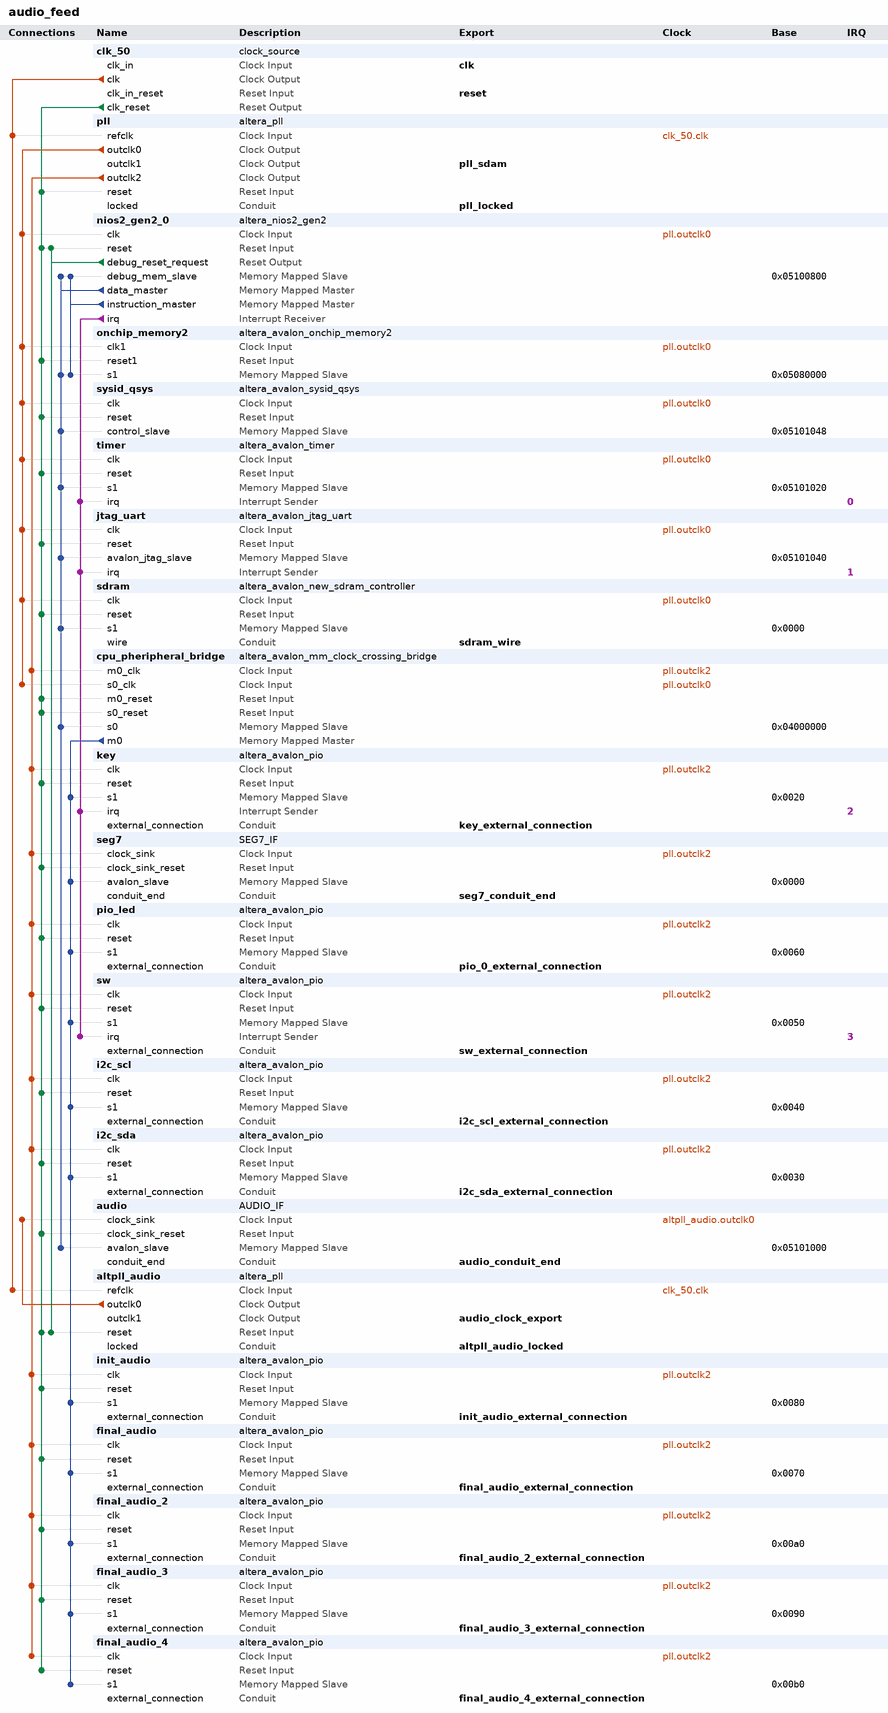
[diagram p0: system contents]
# Platform Designer (Qsys) system audio_feed, Cyclone V 5CSEMA5F31C6
# Parameters at their usual value, and those the tool derives, are not listed.
package require -exact qsys 20.1
create_system audio_feed
set_project_property DEVICE_FAMILY {Cyclone V}
set_project_property DEVICE 5CSEMA5F31C6

add_instance clk_50 clock_source 20.1
set_instance_parameter_value clk_50 clockFrequency 50000000

add_instance pll altera_pll 20.1
set_instance_parameter_value pll gui_device_speed_grade 1
set_instance_parameter_value pll gui_number_of_clocks 3
set_instance_parameter_value pll gui_operation_mode normal
set_instance_parameter_value pll gui_output_clock_frequency0 100.0
set_instance_parameter_value pll gui_output_clock_frequency1 100.0
set_instance_parameter_value pll gui_output_clock_frequency2 10.0
set_instance_parameter_value pll gui_phase_shift_deg1 -90.0
set_instance_parameter_value pll gui_pll_mode {Integer-N PLL}
set_instance_parameter_value pll gui_ps_units1 degrees
set_instance_parameter_value pll gui_reference_clock_frequency 50.0
set_instance_parameter_value pll gui_use_locked true

add_instance nios2_gen2_0 altera_nios2_gen2 20.1
set_instance_parameter_value nios2_gen2_0 dcache_size 2048
set_instance_parameter_value nios2_gen2_0 exceptionSlave onchip_memory2.s1
set_instance_parameter_value nios2_gen2_0 icache_size 4096
set_instance_parameter_value nios2_gen2_0 impl Tiny
set_instance_parameter_value nios2_gen2_0 resetSlave onchip_memory2.s1

add_instance onchip_memory2 altera_avalon_onchip_memory2 20.1
set_instance_parameter_value onchip_memory2 dataWidth 32
set_instance_parameter_value onchip_memory2 dualPort false
set_instance_parameter_value onchip_memory2 initMemContent true
set_instance_parameter_value onchip_memory2 initializationFileName onchip_mem.hex
set_instance_parameter_value onchip_memory2 memorySize 320000

add_instance sysid_qsys altera_avalon_sysid_qsys 20.1
set_instance_parameter_value sysid_qsys id 0

add_instance timer altera_avalon_timer 20.1
set_instance_parameter_value timer period 1
set_instance_parameter_value timer periodUnits MSEC

add_instance jtag_uart altera_avalon_jtag_uart 20.1
set_instance_parameter_value jtag_uart simInteractiveOptions NO_INTERACTIVE_WINDOWS

add_instance sdram altera_avalon_new_sdram_controller 20.1
set_instance_parameter_value sdram TAC 6.0
set_instance_parameter_value sdram TRCD 20.0
set_instance_parameter_value sdram TRP 20.0
set_instance_parameter_value sdram casLatency 3
set_instance_parameter_value sdram columnWidth 10
set_instance_parameter_value sdram dataWidth 16
set_instance_parameter_value sdram generateSimulationModel true
set_instance_parameter_value sdram model single_Micron_MT48LC4M32B2_7_chip
set_instance_parameter_value sdram numberOfBanks 4
set_instance_parameter_value sdram numberOfChipSelects 1
set_instance_parameter_value sdram powerUpDelay 100.0
set_instance_parameter_value sdram refreshPeriod 15.625
set_instance_parameter_value sdram rowWidth 13

add_instance cpu_pheripheral_bridge altera_avalon_mm_clock_crossing_bridge 20.1
set_instance_parameter_value cpu_pheripheral_bridge ADDRESS_WIDTH 9
set_instance_parameter_value cpu_pheripheral_bridge COMMAND_FIFO_DEPTH 32
set_instance_parameter_value cpu_pheripheral_bridge DATA_WIDTH 32
set_instance_parameter_value cpu_pheripheral_bridge MASTER_SYNC_DEPTH 3
set_instance_parameter_value cpu_pheripheral_bridge MAX_BURST_SIZE 1
set_instance_parameter_value cpu_pheripheral_bridge RESPONSE_FIFO_DEPTH 64
set_instance_parameter_value cpu_pheripheral_bridge SLAVE_SYNC_DEPTH 3
set_instance_parameter_value cpu_pheripheral_bridge USE_AUTO_ADDRESS_WIDTH 0

add_instance key altera_avalon_pio 20.1
set_instance_parameter_value key captureEdge true
set_instance_parameter_value key direction Input
set_instance_parameter_value key edgeType FALLING
set_instance_parameter_value key generateIRQ true
set_instance_parameter_value key irqType EDGE
set_instance_parameter_value key simDoTestBenchWiring true
set_instance_parameter_value key simDrivenValue 15
set_instance_parameter_value key width 4

add_instance seg7 SEG7_IF 1.0
set_instance_parameter_value seg7 SEG7_NUM 6

add_instance pio_led altera_avalon_pio 20.1
set_instance_parameter_value pio_led direction Output
set_instance_parameter_value pio_led width 10

add_instance sw altera_avalon_pio 20.1
set_instance_parameter_value sw captureEdge true
set_instance_parameter_value sw direction Input
set_instance_parameter_value sw edgeType FALLING
set_instance_parameter_value sw generateIRQ true
set_instance_parameter_value sw irqType EDGE
set_instance_parameter_value sw simDoTestBenchWiring true
set_instance_parameter_value sw width 10

add_instance i2c_scl altera_avalon_pio 20.1
set_instance_parameter_value i2c_scl direction Output
set_instance_parameter_value i2c_scl width 1

add_instance i2c_sda altera_avalon_pio 20.1
set_instance_parameter_value i2c_sda direction Bidir
set_instance_parameter_value i2c_sda width 1

add_instance audio AUDIO_IF 1.0

add_instance altpll_audio altera_pll 20.1
set_instance_parameter_value altpll_audio gui_device_speed_grade 1
set_instance_parameter_value altpll_audio gui_number_of_clocks 2
set_instance_parameter_value altpll_audio gui_operation_mode normal
set_instance_parameter_value altpll_audio gui_output_clock_frequency0 18.432
set_instance_parameter_value altpll_audio gui_output_clock_frequency1 18.432
set_instance_parameter_value altpll_audio gui_pll_mode {Fractional-N PLL}
set_instance_parameter_value altpll_audio gui_reference_clock_frequency 50.0
set_instance_parameter_value altpll_audio gui_use_locked true

add_instance init_audio altera_avalon_pio 20.1
set_instance_parameter_value init_audio direction Output
set_instance_parameter_value init_audio width 16

add_instance final_audio altera_avalon_pio 20.1
set_instance_parameter_value final_audio direction Input
set_instance_parameter_value final_audio width 16

add_instance final_audio_2 altera_avalon_pio 20.1
set_instance_parameter_value final_audio_2 direction Input
set_instance_parameter_value final_audio_2 width 16

add_instance final_audio_3 altera_avalon_pio 20.1
set_instance_parameter_value final_audio_3 direction Input
set_instance_parameter_value final_audio_3 width 16

add_instance final_audio_4 altera_avalon_pio 20.1
set_instance_parameter_value final_audio_4 direction Input
set_instance_parameter_value final_audio_4 width 16

# connections
add_connection altpll_audio.outclk0 audio.clock_sink clock
add_connection clk_50.clk altpll_audio.refclk clock
add_connection clk_50.clk pll.refclk clock
add_connection pll.outclk0 cpu_pheripheral_bridge.s0_clk clock
add_connection pll.outclk0 jtag_uart.clk clock
add_connection pll.outclk0 nios2_gen2_0.clk clock
add_connection pll.outclk0 onchip_memory2.clk1 clock
add_connection pll.outclk0 sdram.clk clock
add_connection pll.outclk0 sysid_qsys.clk clock
add_connection pll.outclk0 timer.clk clock
add_connection pll.outclk2 cpu_pheripheral_bridge.m0_clk clock
add_connection pll.outclk2 final_audio.clk clock
add_connection pll.outclk2 final_audio_2.clk clock
add_connection pll.outclk2 final_audio_3.clk clock
add_connection pll.outclk2 final_audio_4.clk clock
add_connection pll.outclk2 i2c_scl.clk clock
add_connection pll.outclk2 i2c_sda.clk clock
add_connection pll.outclk2 init_audio.clk clock
add_connection pll.outclk2 key.clk clock
add_connection pll.outclk2 pio_led.clk clock
add_connection pll.outclk2 seg7.clock_sink clock
add_connection pll.outclk2 sw.clk clock
add_connection clk_50.clk_reset altpll_audio.reset reset
add_connection clk_50.clk_reset audio.clock_sink_reset reset
add_connection clk_50.clk_reset cpu_pheripheral_bridge.m0_reset reset
add_connection clk_50.clk_reset cpu_pheripheral_bridge.s0_reset reset
add_connection clk_50.clk_reset final_audio.reset reset
add_connection clk_50.clk_reset final_audio_2.reset reset
add_connection clk_50.clk_reset final_audio_3.reset reset
add_connection clk_50.clk_reset final_audio_4.reset reset
add_connection clk_50.clk_reset i2c_scl.reset reset
add_connection clk_50.clk_reset i2c_sda.reset reset
add_connection clk_50.clk_reset init_audio.reset reset
add_connection clk_50.clk_reset jtag_uart.reset reset
add_connection clk_50.clk_reset key.reset reset
add_connection clk_50.clk_reset nios2_gen2_0.reset reset
add_connection clk_50.clk_reset onchip_memory2.reset1 reset
add_connection clk_50.clk_reset pio_led.reset reset
add_connection clk_50.clk_reset pll.reset reset
add_connection clk_50.clk_reset sdram.reset reset
add_connection clk_50.clk_reset seg7.clock_sink_reset reset
add_connection clk_50.clk_reset sw.reset reset
add_connection clk_50.clk_reset sysid_qsys.reset reset
add_connection clk_50.clk_reset timer.reset reset
add_connection nios2_gen2_0.debug_reset_request altpll_audio.reset reset
add_connection nios2_gen2_0.debug_reset_request nios2_gen2_0.reset reset
add_connection cpu_pheripheral_bridge.m0 final_audio.s1 avalon
set_connection_parameter_value cpu_pheripheral_bridge.m0/final_audio.s1 baseAddress 0x0070
add_connection cpu_pheripheral_bridge.m0 final_audio_2.s1 avalon
set_connection_parameter_value cpu_pheripheral_bridge.m0/final_audio_2.s1 baseAddress 0x00a0
add_connection cpu_pheripheral_bridge.m0 final_audio_3.s1 avalon
set_connection_parameter_value cpu_pheripheral_bridge.m0/final_audio_3.s1 baseAddress 0x0090
add_connection cpu_pheripheral_bridge.m0 final_audio_4.s1 avalon
set_connection_parameter_value cpu_pheripheral_bridge.m0/final_audio_4.s1 baseAddress 0x00b0
add_connection cpu_pheripheral_bridge.m0 i2c_scl.s1 avalon
set_connection_parameter_value cpu_pheripheral_bridge.m0/i2c_scl.s1 baseAddress 0x0040
add_connection cpu_pheripheral_bridge.m0 i2c_sda.s1 avalon
set_connection_parameter_value cpu_pheripheral_bridge.m0/i2c_sda.s1 baseAddress 0x0030
add_connection cpu_pheripheral_bridge.m0 init_audio.s1 avalon
set_connection_parameter_value cpu_pheripheral_bridge.m0/init_audio.s1 baseAddress 0x0080
add_connection cpu_pheripheral_bridge.m0 key.s1 avalon
set_connection_parameter_value cpu_pheripheral_bridge.m0/key.s1 baseAddress 0x0020
add_connection cpu_pheripheral_bridge.m0 pio_led.s1 avalon
set_connection_parameter_value cpu_pheripheral_bridge.m0/pio_led.s1 baseAddress 0x0060
add_connection cpu_pheripheral_bridge.m0 seg7.avalon_slave avalon
set_connection_parameter_value cpu_pheripheral_bridge.m0/seg7.avalon_slave baseAddress 0x0000
add_connection cpu_pheripheral_bridge.m0 sw.s1 avalon
set_connection_parameter_value cpu_pheripheral_bridge.m0/sw.s1 baseAddress 0x0050
add_connection nios2_gen2_0.data_master audio.avalon_slave avalon
set_connection_parameter_value nios2_gen2_0.data_master/audio.avalon_slave baseAddress 0x05101000
add_connection nios2_gen2_0.data_master cpu_pheripheral_bridge.s0 avalon
set_connection_parameter_value nios2_gen2_0.data_master/cpu_pheripheral_bridge.s0 baseAddress 0x04000000
add_connection nios2_gen2_0.data_master jtag_uart.avalon_jtag_slave avalon
set_connection_parameter_value nios2_gen2_0.data_master/jtag_uart.avalon_jtag_slave baseAddress 0x05101040
add_connection nios2_gen2_0.data_master nios2_gen2_0.debug_mem_slave avalon
set_connection_parameter_value nios2_gen2_0.data_master/nios2_gen2_0.debug_mem_slave baseAddress 0x05100800
add_connection nios2_gen2_0.data_master onchip_memory2.s1 avalon
set_connection_parameter_value nios2_gen2_0.data_master/onchip_memory2.s1 baseAddress 0x05080000
add_connection nios2_gen2_0.data_master sdram.s1 avalon
set_connection_parameter_value nios2_gen2_0.data_master/sdram.s1 baseAddress 0x0000
add_connection nios2_gen2_0.data_master sysid_qsys.control_slave avalon
set_connection_parameter_value nios2_gen2_0.data_master/sysid_qsys.control_slave baseAddress 0x05101048
add_connection nios2_gen2_0.data_master timer.s1 avalon
set_connection_parameter_value nios2_gen2_0.data_master/timer.s1 baseAddress 0x05101020
add_connection nios2_gen2_0.instruction_master nios2_gen2_0.debug_mem_slave avalon
set_connection_parameter_value nios2_gen2_0.instruction_master/nios2_gen2_0.debug_mem_slave baseAddress 0x05100800
add_connection nios2_gen2_0.instruction_master onchip_memory2.s1 avalon
set_connection_parameter_value nios2_gen2_0.instruction_master/onchip_memory2.s1 baseAddress 0x05080000
add_connection nios2_gen2_0.irq jtag_uart.irq interrupt
set_connection_parameter_value nios2_gen2_0.irq/jtag_uart.irq irqNumber 1
add_connection nios2_gen2_0.irq key.irq interrupt
set_connection_parameter_value nios2_gen2_0.irq/key.irq irqNumber 2
add_connection nios2_gen2_0.irq sw.irq interrupt
set_connection_parameter_value nios2_gen2_0.irq/sw.irq irqNumber 3
add_connection nios2_gen2_0.irq timer.irq interrupt
set_connection_parameter_value nios2_gen2_0.irq/timer.irq irqNumber 0

# exported interfaces
add_interface altpll_audio_locked conduit end
set_interface_property altpll_audio_locked EXPORT_OF altpll_audio.locked
add_interface audio_clock_export clock source
set_interface_property audio_clock_export EXPORT_OF altpll_audio.outclk1
add_interface audio_conduit_end conduit end
set_interface_property audio_conduit_end EXPORT_OF audio.conduit_end
add_interface clk clock sink
set_interface_property clk EXPORT_OF clk_50.clk_in
add_interface final_audio_2_external_connection conduit end
set_interface_property final_audio_2_external_connection EXPORT_OF final_audio_2.external_connection
add_interface final_audio_3_external_connection conduit end
set_interface_property final_audio_3_external_connection EXPORT_OF final_audio_3.external_connection
add_interface final_audio_4_external_connection conduit end
set_interface_property final_audio_4_external_connection EXPORT_OF final_audio_4.external_connection
add_interface final_audio_external_connection conduit end
set_interface_property final_audio_external_connection EXPORT_OF final_audio.external_connection
add_interface i2c_scl_external_connection conduit end
set_interface_property i2c_scl_external_connection EXPORT_OF i2c_scl.external_connection
add_interface i2c_sda_external_connection conduit end
set_interface_property i2c_sda_external_connection EXPORT_OF i2c_sda.external_connection
add_interface init_audio_external_connection conduit end
set_interface_property init_audio_external_connection EXPORT_OF init_audio.external_connection
add_interface key_external_connection conduit end
set_interface_property key_external_connection EXPORT_OF key.external_connection
add_interface pio_0_external_connection conduit end
set_interface_property pio_0_external_connection EXPORT_OF pio_led.external_connection
add_interface pll_locked conduit end
set_interface_property pll_locked EXPORT_OF pll.locked
add_interface pll_sdam clock source
set_interface_property pll_sdam EXPORT_OF pll.outclk1
add_interface reset reset sink
set_interface_property reset EXPORT_OF clk_50.clk_in_reset
add_interface sdram_wire conduit end
set_interface_property sdram_wire EXPORT_OF sdram.wire
add_interface seg7_conduit_end conduit end
set_interface_property seg7_conduit_end EXPORT_OF seg7.conduit_end
add_interface sw_external_connection conduit end
set_interface_property sw_external_connection EXPORT_OF sw.external_connection

set_interconnect_requirement {$system} qsys_mm.clockCrossingAdapter HANDSHAKE
set_interconnect_requirement {$system} qsys_mm.enableEccProtection FALSE
set_interconnect_requirement {$system} qsys_mm.insertDefaultSlave FALSE
set_interconnect_requirement {$system} qsys_mm.maxAdditionalLatency 1

save_system audio_feed.qsys
